# EAGLE schematic device (EAGLE 6.5.0)
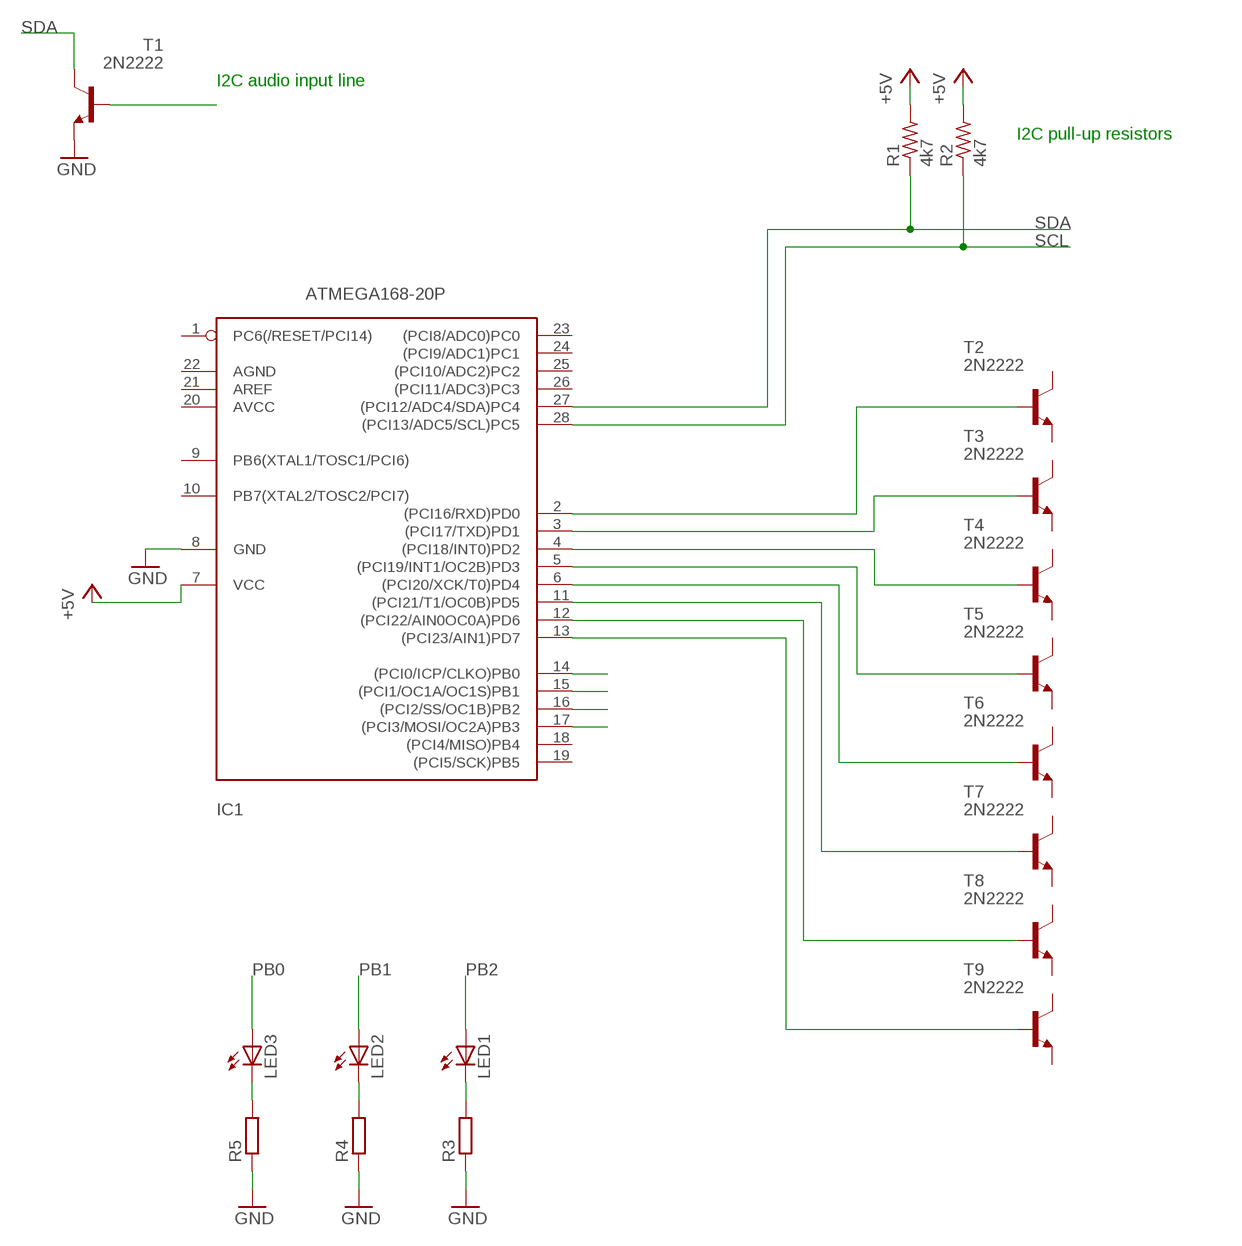
[diagram p0: schematic, sheet 1]

## Parts
IC1  ATMEGA168-20P  [DIL28-3]
LED1  LED_ELD260  [LED_LD260]
LED2  LED_ELD260  [LED_LD260]
LED3  LED_ELD260  [LED_LD260]
R1  4k7  R-US_0204/2V  [0204V]
R2  4k7  R-US_0204/2V  [0204V]
R3  R-EU_0204/5  [0204/5]
R4  R-EU_0204/5  [0204/5]
R5  R-EU_0204/5  [0204/5]
T1  2N2222  [TO92-EBC-OVAL]
T2  2N2222  [TO92-EBC-OVAL]
T3  2N2222  [TO92-EBC-OVAL]
T4  2N2222  [TO92-EBC-OVAL]
T5  2N2222  [TO92-EBC-OVAL]
T6  2N2222  [TO92-EBC-OVAL]
T7  2N2222  [TO92-EBC-OVAL]
T8  2N2222  [TO92-EBC-OVAL]
T9  2N2222  [TO92-EBC-OVAL]

## Nets
+5V: IC1.7(VCC) R1.2 R2.2
GND: IC1.8(GND) R3.1 R4.1 R5.1 T1.E
N$1: IC1.2((PCI16/RXD)PD0) T2.B
N$2: IC1.3((PCI17/TXD)PD1) T3.B
N$3: IC1.4((PCI18/INT0)PD2) T4.B
N$4: IC1.5((PCI19/INT1/OC2B)PD3) T5.B
N$5: IC1.6((PCI20/XCK/T0)PD4) T6.B
N$6: IC1.11((PCI21/T1/OC0B)PD5) T7.B
N$7: IC1.12((PCI22/AIN0OC0A)PD6) T8.B
N$8: IC1.13((PCI23/AIN1)PD7) T9.B
N$9: LED3.K(C) R5.2
N$10: LED2.K(C) R4.2
N$11: LED1.K(C) R3.2
PB0: IC1.14((PCI0/ICP/CLKO)PB0) LED3.A
PB1: IC1.15((PCI1/OC1A/OC1S)PB1) LED2.A
PB2: IC1.16((PCI2/SS/OC1B)PB2) LED1.A
PB3: IC1.17((PCI3/MOSI/OC2A)PB3)
SCL: IC1.28((PCI13/ADC5/SCL)PC5) R2.1
SDA: IC1.27((PCI12/ADC4/SDA)PC4) R1.1 T1.C
SDF: T1.B
Unconnected: IC1.1(PC6(/RESET/PCI14)) IC1.9(PB6(XTAL1/TOSC1/PCI6)) IC1.10(PB7(XTAL2/TOSC2/PCI7)) IC1.18((PCI4/MISO)PB4) IC1.19((PCI5/SCK)PB5) IC1.20(AVCC) IC1.21(AREF) IC1.22(AGND) IC1.23((PCI8/ADC0)PC0) IC1.24((PCI9/ADC1)PC1) IC1.25((PCI10/ADC2)PC2) IC1.26((PCI11/ADC3)PC3) T2.C T2.E T3.C T3.E T4.C T4.E T5.C T5.E T6.C T6.E T7.C T7.E T8.C T8.E T9.C T9.E

## Notes on the sheet
- I2C audio input line
- I2C pull-up resistors

## Library data of the parts
IC1 = adafruit:ATMEGA168*P: MICROCONTROLLER 16 kBytes FLASH 1 kBytes SRAM 512 Bytes EEPROM USART 8-channel 10 bit ADC
LED1-LED3 = eagle-ltspice:LED_E: LED Source: http://www.osram.convergy.de Source: www.luxeon.com Source: www.kingbright.com; SPICEMODEL: NONE; SPICEPREFIX: D; SPICETYPE: diode
R1 R2 = adafruit:R-US_: RESISTOR, American symbol
R3-R5 = resistor:R-EU_: RESISTOR, European symbol
T1-T9 = adafruit:2N2222: NPN TRANSISTOR Big oval pads